# EAGLE design Pressure_Converter (EAGLE 9.6.2)
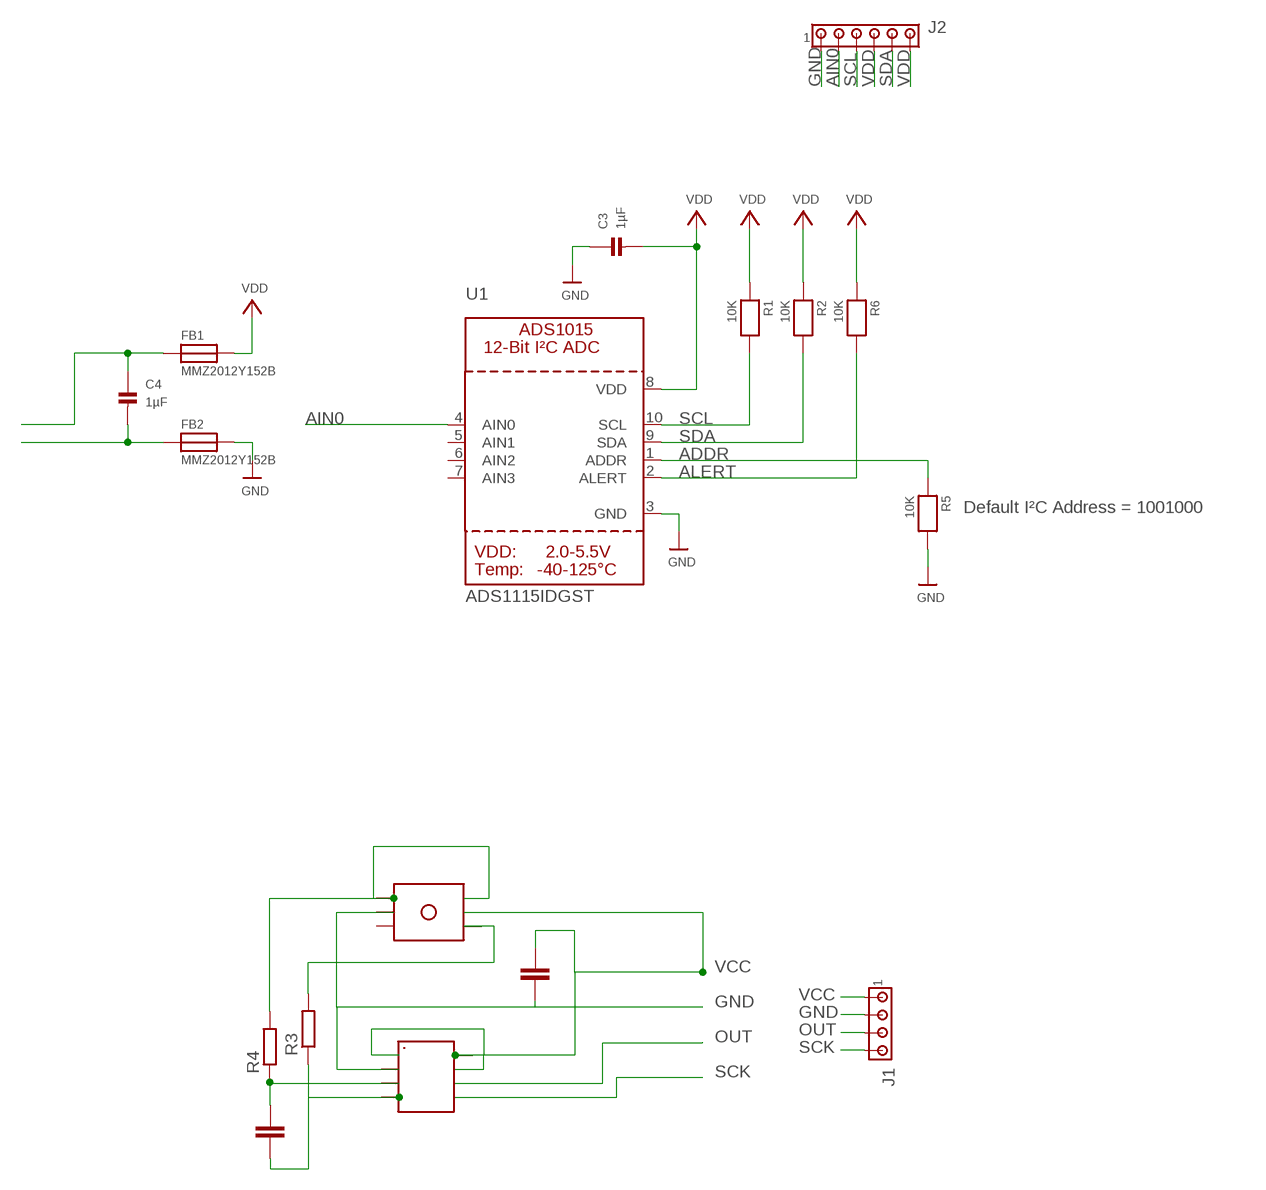
[diagram p0: schematic, sheet 1]

## Parts
C1  100n  C-EUC0805  [C0805]
C2  100n  C-EUC0805  [C0805]
C3  1µF  CAP_CERAMIC0805  [0805]
C4  1µF  CAP_CERAMIC0805  [0805]
FB1  MMZ2012Y152B  FERRITE0805  [0805]
FB2  MMZ2012Y152B  FERRITE0805  [0805]
J1  MTA04-100  [10X04MTA]
J2  MTA06-156  [1X6MTA]
R1  10K  RESISTOR0805  [0805]
R2  10K  RESISTOR0805  [0805]
R3  R-EU_R0805  [R0805]
R4  R-EU_R0805  [R0805]
R5  10K  RESISTOR0805  [0805]
R6  10K  RESISTOR0805  [0805]
U1  ADS1115IDGST  ADC_ADS1015  [MSOP10]
U$1  HX710B  [HX710B]
U$2  PRESSURE  [PRESSURE]

## Nets
ADDR: R5.1 U1.1(ADDR)
AIN0: J2.2 U1.4(AIN0)
ALERT: R6.2 U1.2(ALERT)
GND: C1.2 C3.1 FB2.2 J1.2 J2.1 R5.2 U1.3(GND) U$1.AGND U$2.2
N$1: C2.2 R4.1 U$1.INN
N$2: C2.1 R3.1 U$1.INP
N$3: R3.2 U$2.4
N$4: R4.2 U$2.1 U$2.6
N$5: C4.2 FB2.1
N$6: C4.1 FB1.1
OUT: J1.3 U$1.DOUT
SCK: J1.4 U$1.SCK
SCL: J2.3 R1.2 U1.10(SCL)
SDA: J2.5 R2.2 U1.9(SDA)
VCC: C1.1 J1.1 U$1.AVDD U$1.DVDD U$1.VREF U$2.5
VDD: C3.2 FB1.2 J2.4 J2.6 R1.1 R2.1 R6.1 U1.8(VDD)
Unconnected: U1.5(AIN1) U1.6(AIN2) U1.7(AIN3) U$2.3

## Notes on the sheet
- Default I²C Address = 1001000

## Library data of the parts
C1 C2 = rcl@1:C-EU: CAPACITOR, European symbol
C3 C4 = microbuilder:CAP_CERAMIC: Ceramic Capacitors 0402 - 0402 Surface Mount Capacitors 16pF 50V 5% [Digikey: 445-4899-2-ND] 18pF 50V 5% [Digikey: 490-1281-2-ND] 22pF 50V 5% [Digikey: 490-1283-2-ND] 68pF 50V 5% [Digikey: 490-1289-2-ND] 0.1uF 10V 10% [Digikey: 490-1318-2-ND] 1.0uF 6.3V 10% [Digikey: 490-1320-2-ND] 0603 - 0603 Surface Mount Capacitors 16 pF 50V 5% [Digikey: 445-5051-2-ND] 22 pF 50V [Digikey: PCC220ACVTR-ND] 33 pF 50V 5% [Digikey: 490-1415-1-ND] 56pF 50V 5% [Digikey: 490-1421-1-ND] 220pF 50V 5% [Digikey: 445-1285-1-ND] 680 pF 50V 2200 pF 50V 5% C0G [Digikey: 445-1297-1-ND] 5600 pF 100V 5% X7R [Digikey: 478-3711-1-ND] 0.1 µF 25V 10% [Digikey: PCC2277TR-ND] 0.22 µF 16V 10% X7R [Digikey: 445-1318-1-ND] 1.0 µF 25V 10% [Digikey: 445-5146-2-ND] 0603 - RF Specific 3pF 250V +/-0.1pF RF [Digikey: 712-1347-1-ND] 18 pF 250V 5% [Digikey: 478-3505-1-ND or 712-1322-1-ND] 56 pF 250V 5% C0G RF [Digikey: 490-4867-1-ND] 68 pF 250V RF [Digikey: 490-4868-1-ND] 0805 - 0805 Surface Mount Capacitors 220 pF 250V 2% RF Ceramic Capacitor [Digikey: 712-1398-1-ND] 1000 pF 50V 2% NP0 Ceramic Capacitor [Digikey: 478-3760-1-ND] 0.1 µF 25V 10% Ceramic Capacitor [Digikey: PCC1828TR-ND] 1.0 µF 16V 10% Ceramic Capacitor[Digikey: 490-1691-2-ND] 10.0 µF 10V 10% Ceramic Capacitor[Digikey: 709-1228-1-ND] 10.0 uF 16V 10% Ceramic Capacitor [Digikey: 478-5165-2-ND] 47 uF 6.3V 20% Ceramic Capacitor [Digikey: 587-1779-1-ND or 399-5506-1-ND] 1206 - 1206 Surface Mount Capacitors 47uF 10V 20% Ceramic Capacitor [Digikey: 490-5528-1-ND or 399-5508-1-ND or 445-6010-1-ND] 100uF 6.3V -20%, +80% Y5V Ceramic Capacitor (Digikey: 490-4512-1-ND, Mouser: 81-GRM31CF50J107ZE1L)
FB1 FB2 = microbuilder:FERRITE: Ferrite Bead 0603 MMZ1608B121C - 120 Ohm, 600mA Ferrite Chip - Digikey: 445-2164-1-ND BK1608HW121-T - 120 Ohm, 600mA Ferrite Chip - Digikey: 587-1876-2-ND 0805 HZ0805B272R-10 - 2.7K Ohm @ 100MHz, 200mA 0.8 Ohm DC Resistance - Digikey: 240-2504-1-ND (see also Murata BLM21BD272SN1L)
J1 = con-amp:MTA04-100: AMP connector
J2 = con-amp:MTA06-156: AMP connector
R1 R2 R5 R6 = microbuilder:RESISTOR: Resistors 0402 - 0402 Surface Mount Package 22 Ohm 1% 1/16W [Digikey: 311-22.0LRTR-ND] 33 Ohm 5% 1/16W 1.0K 5% 1/16W 1.5K 5% 1/16W 2.0K 1% 1/16W 10.0K 1% 1/16W [Digikey: 311-10.0KLRTR-ND] 10.0K 5% 1/16W [Digikey: RMCF0402JT10K0TR-ND] 12.1K 1% 1/16W [Digikey: 311-22.0LRTR-ND] 100.0K 5% 1/16W 0603 - 0603 Surface Mount Package 0 Ohm 1/10 Watt 1% Resistor 15 Ohm 1/10 Watt 1% Resistor 33 Ohm 1/10 Watt 1% Resistor 49.9 Ohm 1/10 Watt 1% Resistor 100 Ohm 1/10 Watt 1% Resistor 150 Ohm 1/10 Watt 1% Resistor 240 Ohm 1/10 Watt 1% Resistor 390 Ohm 1/10 Watt 1% Resistor 560 Ohm 1/10 Watt 1% Resistor 680 Ohm 1/10 Watt 1% Resistor 750 Ohm 1/10 Watt 1% Resistor 1.0K Ohm 1/10 Watt 1% Resistor 1.5K Ohm 1/10 Watt 1% Resistor 2.0K Ohm 1/10 Watt 1% Resistor 2.2K Ohm 1/10 Watt 1% Resistor 3.3K Ohm 1/10 Watt 1% Resistor 4.7K Ohm 1/10 Watt 1% Resistor 10.0K Ohm 1/10 Watt 1% Resistor 12.0K Ohm 1/10 Watt 1% Resistor 12.1K Ohm 1/10 Watt 1% Resistor 20.0K Ohm 1/10 Watt 1% Resistor 33.0K Ohm 1/10 Watt 1% Resistor 100.0K Ohm 1/10 Watt 1% Resistor 0805 - 0805 Surface Mount Package 0 Ohm 1/8 Watt 1% Resistor 33 Ohm 1/8 Watt 1% Resistor 100 Ohm 1/8 Watt 1% Resistor 150 Ohm 1/8 Watt 1% Resistor 200 Ohm 1/8 Watt 1% Resistor 240 Ohm 1/8 Watt 1% Resistor 330 Ohm 1/8 Watt 1% Resistor 390 Ohm 1/8 Watt 1% Resistor 470 Ohm 1/8 Watt 1% Resistor 1.0K Ohm 1/8 Watt 1% Resistor 1.5K Ohm 1/8 Watt 1% Resistor 2.0K Ohm 1/8 Watt 1% Resistor 4.7K Ohm 1/8 Watt 1% Resistor 5.1K Ohm 1/8 Watt 1% Resistor 5.6K Ohm 1/8 Watt 1% Resistor 10.0K Ohm 1/8 Watt 1% Resistor 22.0K Ohm 1/8 Watt 1% Resistor 33.0K Ohm 1/8 Watt 1% Resistor 100K Ohm 1/8 Watt 1% Resistor 1206 - 1206 Surface Mount Package 2012 - 2010 Surface Mount Package 0.11 Ohm 1/2 Watt 1% Resistor - Digikey: RHM.11UCT-ND
R3 R4 = rcl:R-EU_: RESISTOR, European symbol; SPICEPREFIX: R
U1 = microbuilder:ADC_ADS1015: ADS1015 - 12-bit 4-Channel I2C ADC with Internal PGA VDD: 2.0-5.5V Sampling Rate: 3.3ksps Gain Settings: 2/3, 1, 2, 4, 8, 16 I2C Address: ADDR low = 1001000x, ADDR high = 1001001x Internal Comparator The ADS1015 includes an internal comparator that can be set to output a high-level on ALERT when the conversion results exceeeds a pre-defined upper level, and will deassert itself when the level falls below a pre-defined lower threshold level. It can also be set to windowed mode where the ALERT pin will be asserted if the data exceeds the upper threshold or falls below the lower threshold.
U$1 = HX710B:HX710B
U$2 = PRESSURE:PRESSURE

## Board
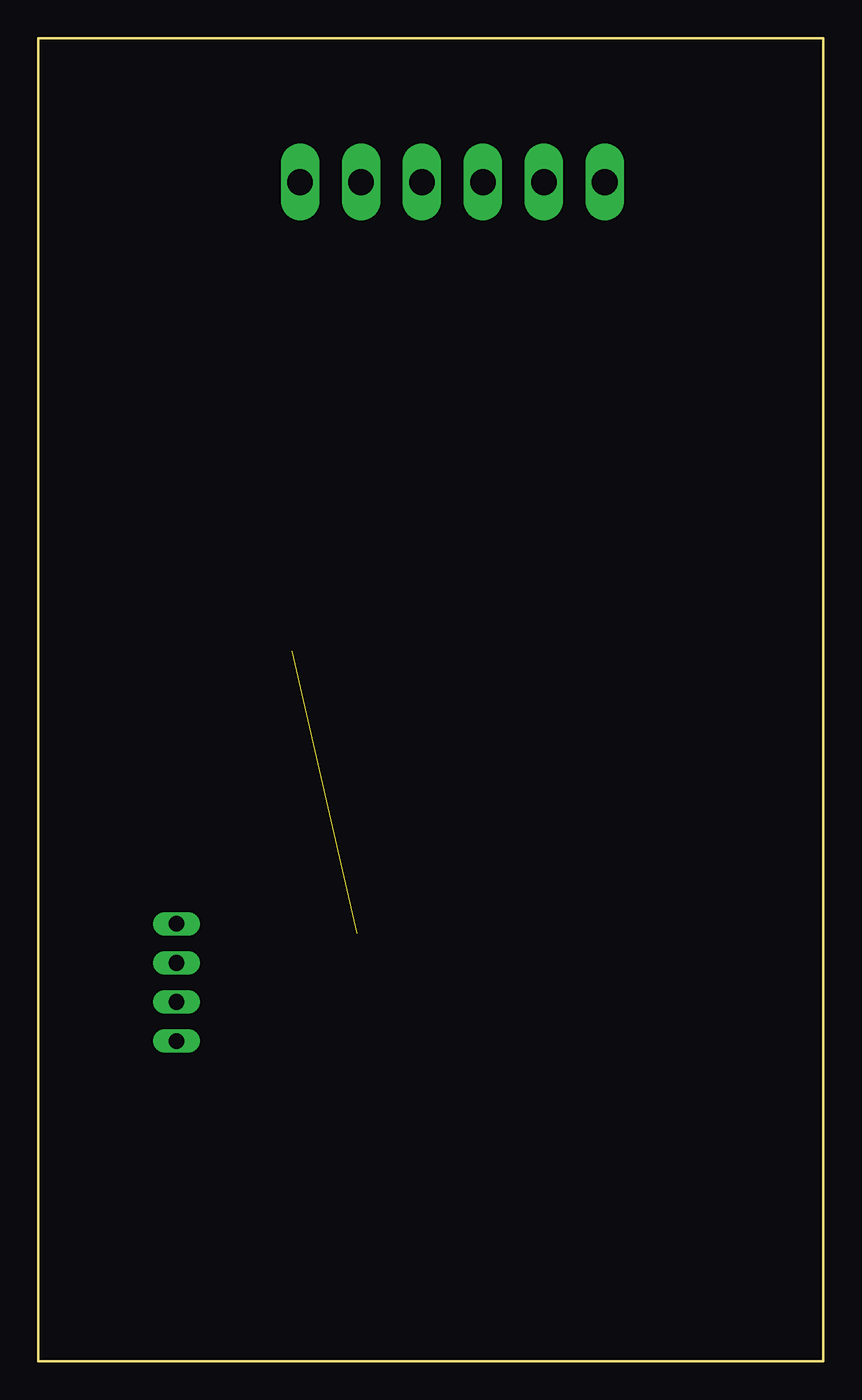
[diagram p1: board, top side]
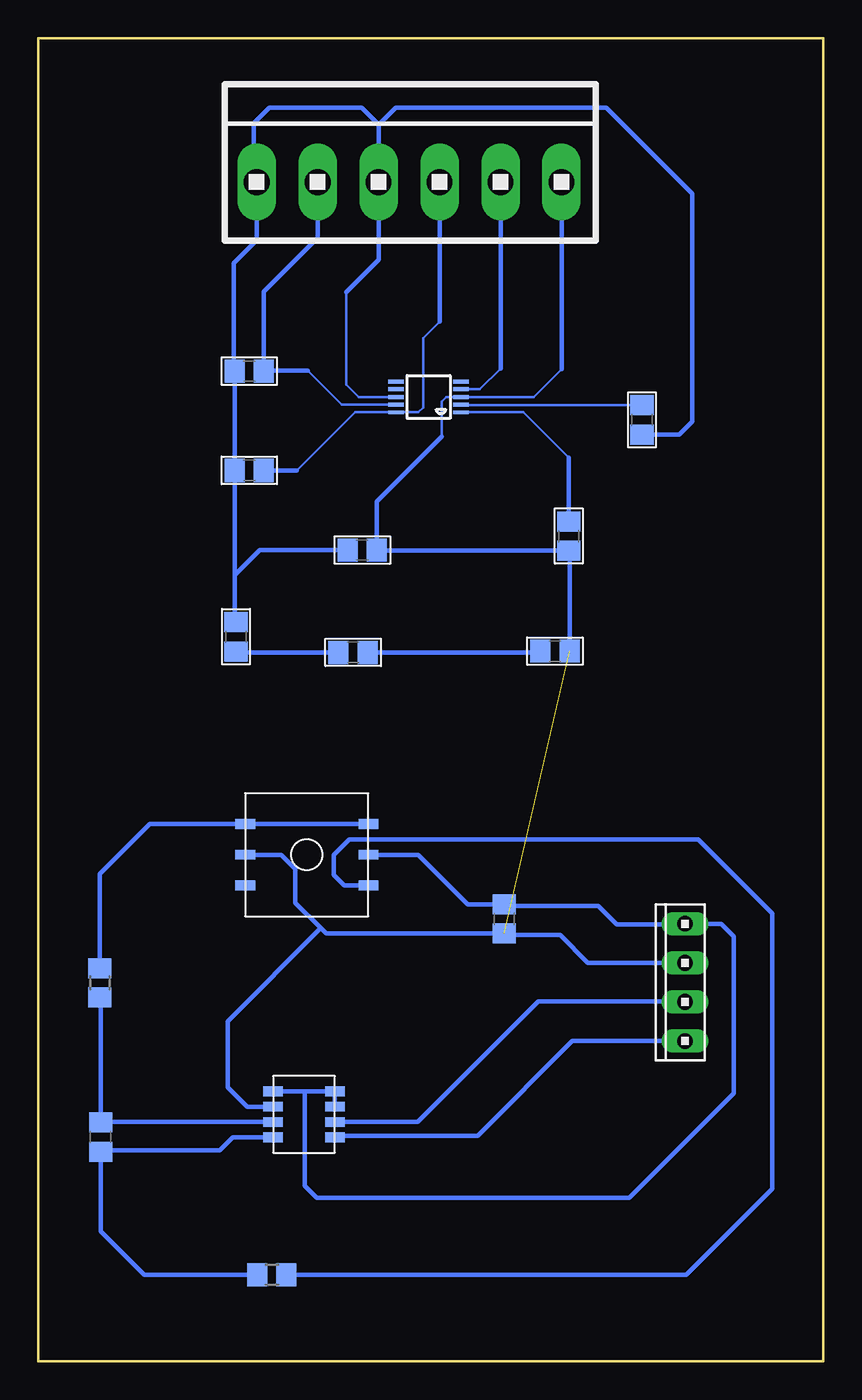
[diagram p2: board, bottom side, seen from below]

Size 51 x 86 mm. Coordinates in mm from the lower left corner, seen from the top.
Outline: 0,0 0,86 51,86 51,0 0,0
Copper layers (1*16): Top 0.035mm / dielectric 1.5mm / Bottom 0.035mm
Design rules "default": minimum track width 6mil, minimum drill 0.35mm, track to track 6mil, track to pad 6mil, pad to pad 6mil, via to via 6mil, smd to smd 6mil, copper to edge 40mil, drill to drill 6mil, minimum pad ring 10mil, minimum via ring 8mil, stop-mask expansion 4mil, vias tented up to drill 0mil, thermal gap 10mil

### Footprints (pad centres in the part's own frame; a part is rotated, then mirrored left to right if it is on the bottom)
C0805 = smd 1.3 x 1.5: 1 -0.95,0; 2 0.95,0
0805 = smd 1.3 x 1.5: 1 -0.95,0; 2 0.95,0
10X04MTA = drill 1.016 long: 1 3.81,0; 2 1.27,0; 3 -1.27,0; 4 -3.81,0
1X6MTA = drill 1.676 long: 1 9.906,0; 2 5.944,0; 3 1.981,0; 4 -1.981,0; 5 -5.944,0; 6 -9.906,0
R0805 = smd 1.3 x 1.5: 1 -0.95,0; 2 0.95,0
MSOP10 = smd 0.25 x 1: 1 -1,-2.113; 2 -0.5,-2.113; 3 0,-2.113; 4 0.5,-2.113; 5 1,-2.113; 6 1,2.113; 7 0.5,2.113; 8 0,2.113; 9 -0.5,2.113; 10 -1,2.113
HX710B = smd 1.27 x 0.635: AGND -5,4; AVDD -1,5; DOUT -1,3; DVDD -1,4; INN -5,3; INP -5,2; SCK -1,2; VREF -5,5
PRESSURE = smd 1.27 x 0.635: 1 -9,7; 2 -9,5; 3 -9,3; 4 -1,3; 5 -1,5; 6 -1,7

### Placement (x,y rotation side)
C1  20.72,28.75 270 bottom
C2  46.96,14.57 90 bottom
C3  29.95,52.73 180 bottom
C4  30.55,46.08 0 bottom
FB1  38.16,47.1 90 bottom
FB2  17.43,46.16 0 bottom
J1  8.97,24.62 90 bottom
J2  26.91,76.66 0 bottom
R1  37.3,57.92 0 bottom
R2  37.3,64.37 0 bottom
R3  35.83,5.61 0 bottom
R4  47.01,24.59 90 bottom
R5  16.53,53.65 270 bottom
R6  11.77,61.2 90 bottom
U1  25.64,62.69 90 bottom
U$1  30.74,12.54 0 bottom
U$2  28.56,27.92 0 bottom

### Tracks (layer width: path | path; a pad name or v marks a point on that pad's centre or on a via)
ADDR
  Bottom 0.152: 16.53,58.73 19.5,61.7 23.52,61.7 U1.1
  Bottom 0.305: R5.1 16.53,58.73
AIN0
  Bottom 0.152: U1.4 22.31,63.19 20.97,64.53
  Bottom 0.305: 20.97,64.53 J2.2
ALERT
  Bottom 0.152: U1.2 23.51,62.19 23.47,62.15 R6.2
GND  (1 unrouted)
  Bottom 0.152: 17,64.5 18.81,62.69 U1.3 24.51,62.69 24.8,62.4 24.8,60.1 | J2.1 | 16.48,52.65 R5.2 | C3.1 28.97,52.7 | 20.62,27.7 C1.2
  Bottom 0.305: 17,64.5 J2.1 | FB2.2 16.48,52.65 | R5.2 28.97,52.7 | 24.8,60.1 29,55.9 C3.1 | J1.2 15.29,25.89 17.1,27.7 20.62,27.7 | C1.2 32.3,27.8 32.65,28.15 | U$2.2 35.22,32.92 34.3,32 34.3,29.8 32.65,28.15 | U$1.AGND 37.44,16.54 38.7,17.8 38.7,22.1 32.65,28.15
N$1
  Bottom 0.152: 46.94,15.54 C2.2 | 46.96,23.59 R4.1
  Bottom 0.305: U$1.INN 46.94,15.54 | C2.2 46.96,23.59
N$2
  Bottom 0.152: C2.1 46.94,13.64 46.88,13.7
  Bottom 0.305: U$1.INP 38.36,14.54 39.2,13.7 46.88,13.7 | R3.1 44.11,5.61 46.94,8.44 46.94,13.64
N$3
  Bottom 0.305: R3.2 8.89,5.61 3.3,11.2 3.3,29.1 8.1,33.9 30.8,33.9 31.8,32.9 31.8,31.6 31.12,30.92 U$2.4
N$4
  Bottom 0.305: R4.2 47.01,31.69 43.78,34.92 U$2.1 U$2.6
N$5
  Bottom 0.152: 18.46,46.08 FB2.1
  Bottom 0.305: C4.2 18.46,46.08
N$6
  Bottom 0.152: 38.09,46.08 FB1.1
  Bottom 0.305: C4.1 38.09,46.08
OUT
  Bottom 0.152: 9.02,23.4 J1.3
  Bottom 0.305: U$1.DOUT 26.36,15.54 18.5,23.4 9.02,23.4
SCK
  Bottom 0.152: 31.64,14.64 U$1.SCK
  Bottom 0.305: J1.4 16.29,20.81 22.46,14.64 31.64,14.64
SCL
  Bottom 0.152: 24.93,67.57 26,66.5 26,62 26.31,61.69 U1.10 30.41,61.69 34.2,57.9 | 36.33,57.9 R1.2
  Bottom 0.305: 24.93,67.57 J2.3 | 34.2,57.9 36.33,57.9
SDA
  Bottom 0.152: U1.9 31.29,62.19 33.5,64.4 | 36.32,64.4 R2.2
  Bottom 0.305: J2.5 32.85,73.05 36.35,69.55 R2.2 | 33.5,64.4 36.32,64.4
VCC
  Bottom 0.152: C1.1 20.62,29.6 | 9,28.4 J1.1
  Bottom 0.305: 33.7,17.54 U$1.AVDD U$1.DVDD | 33.7,17.54 U$1.VREF | U$2.5 26.32,32.92 23.1,29.7 C1.1 | 20.62,29.6 14.6,29.6 13.4,28.4 9,28.4 | J1.1 6.63,28.43 5.8,27.6 5.8,17.4 12.6,10.6 32.9,10.6 33.7,11.4 33.7,17.54
VDD
  Bottom 0.152: U1.8 30.19,62.69 31,63.5 31,69.5 | 37,76.84 J2.6 | R2.1 38.25,64.1 38.3,64.15 | 38.25,48.14 FB1.2
  Bottom 0.305: 31,69.5 28.89,71.61 J2.4 28.89,80.39 | 28.89,80.39 30,81.5 36,81.5 37,80.5 37,76.84 | 38.25,64.1 R1.1 38.25,51.1 | 38.25,51.1 38.25,48.14 | C3.2 36.62,52.73 38.25,51.1 | R6.1 9.35,60.25 8.5,61.1 8.5,75.9 14.1,81.5 27.78,81.5 28.89,80.39 | J2.6 36.82,72.88 38.3,71.4 38.3,64.15